# Altium schematic sheet LOCAL_POWER.SchDoc: FMC 5GS/s ADC/TDC
size 420 x 297 mm; Author: Agnieszka Bartkowicz; CompanyName: WUT ISE; DrawnBy: Agnieszka Bartkowicz; Engineer: Agnieszka Bartkowicz; Organization: WUT ISE; Address1: PW ISE; Address2: Nowowiejska 15/19 00-665 Warsaw; Address3: gyorka@o2.pl; SheetNumber: 10; SheetTotal: 14; ModifiedBy: -; CheckedDate: -; Title2: Title 2; DivGrp: WUT ISE; Designer: A. Bartkowicz
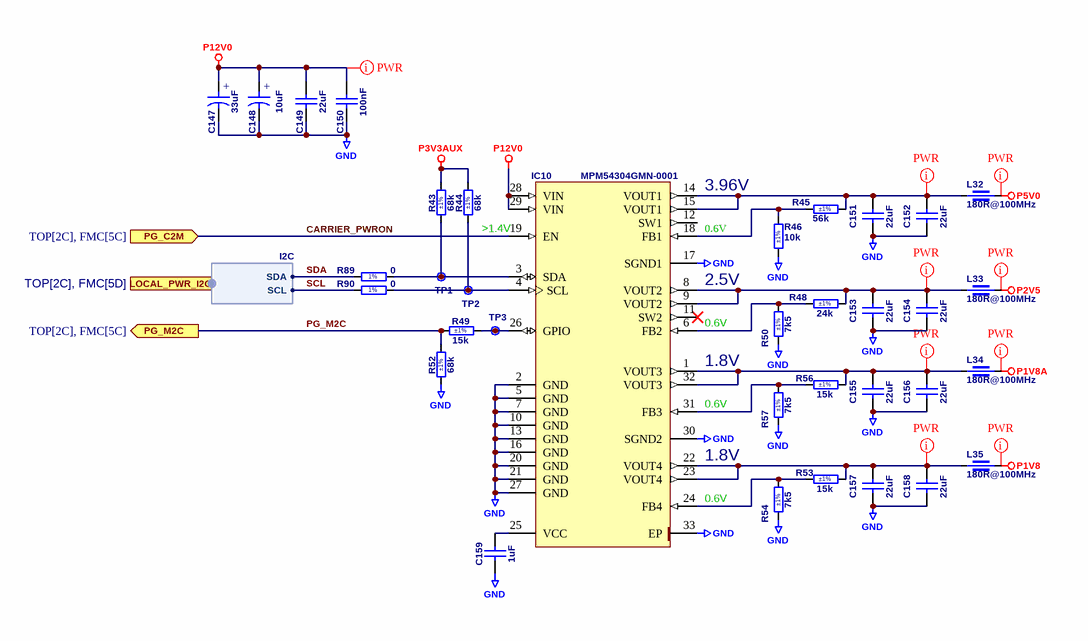
[diagram p0: LOCAL_POWER.SchDoc]

## Parts
C147  33uF  [CAPMP3528X210N]
C148  10uF  [CAPMP3216X180N]
C149  22uF  [CAPC2012X135N]
C150  100nF  [CAPC1005X55N]
C151  22uF  [CAPC2012X135N]
C152  22uF  [CAPC2012X135N]
C153  22uF  [CAPC2012X135N]
C154  22uF  [CAPC2012X135N]
C155  22uF  [CAPC2012X135N]
C156  22uF  [CAPC2012X135N]
C157  22uF  [CAPC2012X135N]
C158  22uF  [CAPC2012X135N]
C159  1uF  [CAPC1005X55N]
IC10  MPM54304GMN-0001  [MPS_MPM54304GMN]
L32  180R@100MHz  [INDC2012X105N]
L33  180R@100MHz  [INDC2012X105N]
L34  180R@100MHz  [INDC2012X105N]
L35  180R@100MHz  [INDC2012X105N]
R43  68k  Tolerance: ±1%  [RESC1005X40N]
R44  68k  Tolerance: ±1%  [RESC1005X40N]
R45  56k  Tolerance: ±1%  [RESC1005X40N]
R46  10k  Tolerance: ±1%  [RESC1005X40N]
R48  24k  Tolerance: ±1%  [RESC1005X40N]
R49  15k  Tolerance: ±1%  [RESC1005X40N]
R50  7k5  Tolerance: ±1%  [RESC1005X40N]
R52  68k  Tolerance: ±1%  [RESC1005X40N]
R53  15k  Tolerance: ±1%  [RESC1005X40N]
R54  7k5  Tolerance: ±1%  [RESC1005X40N]
R56  15k  Tolerance: ±1%  [RESC1005X40N]
R57  7k5  Tolerance: ±1%  [RESC1005X40N]
R89  0  [RESC1005X40N]
R90  0  [RESC1005X40N]
TP1  Test Point  [TPS127]  (value not drawn)  (no BOM)
TP2  Test Point  [TPS127]  (value not drawn)  (no BOM)
TP3  Test Point  [TPS127]  (value not drawn)  (no BOM)

## Ports
LOCAL_PWR_I2C (harness I2C, see TOP[2C], FMC[5D]), PG_C2M (in, see TOP[2C], FMC[5C]), PG_M2C (out, see TOP[2C], FMC[5C])

## Harnesses
I2C: SCL, SDA

## Nets
GND: C147.2 C148.2 C149.1 C150.1 C151.1 C152.1 C153.1 C154.1 C155.1 C156.1 C157.1 C158.1 C159.1 IC10.2(GND) IC10.5(GND) IC10.7(GND) IC10.10(GND) IC10.13(GND) IC10.16(GND) IC10.17(SGND1) IC10.20(GND) IC10.21(GND) IC10.27(GND) IC10.30(SGND2) IC10.33(EP) R46.1 R50.1 R52.1 R54.1 R57.1
P1V8: L35.2
P1V8A: L34.2
P2V5: L33.2
P3V3AUX: R43.2 R44.2
P5V0: L32.2
P12V0: C147.1 C148.1 C149.2 C150.2 IC10.28(VIN) IC10.29(VIN)
CARRIER_PWRON: IC10.19(EN) ; port PG_C2M
PG_M2C: R49.1 R52.2 ; port PG_M2C
SCL: R90.2 ; port LOCAL_PWR_I2C.SCL
SDA: R89.2 ; port LOCAL_PWR_I2C.SDA
NetC151_2: C151.2 C152.2 IC10.14(VOUT1) IC10.15(VOUT1) L32.1 R45.2
NetC153_2: C153.2 C154.2 IC10.8(VOUT2) IC10.9(VOUT2) L33.1 R48.2
NetC155_2: C155.2 C156.2 IC10.1(VOUT3) IC10.32(VOUT3) L34.1 R56.2
NetC157_2: C157.2 C158.2 IC10.22(VOUT4) IC10.23(VOUT4) L35.1 R53.2
NetC159_2: C159.2 IC10.25(VCC)
NetIC10_3: IC10.3(SDA) R43.1 R89.1 TP1.1
NetIC10_4: IC10.4(SCL) R44.1 R90.1 TP2.1
NetIC10_6: IC10.6(FB2) R48.1 R50.2
NetIC10_18: IC10.18(FB1) R45.1 R46.2
NetIC10_24: IC10.24(FB4) R53.1 R54.2
NetIC10_26: IC10.26(GPIO) R49.2 TP3.1
NetIC10_31: IC10.31(FB3) R56.1 R57.2

Not connected (* = marked no-connect by the designer): IC10 11(SW2)* 12(SW1)

## Layout directives
net class PWR: NetC151_2, NetC153_2, NetC155_2, NetC157_2, P1V8, P1V8A, P2V5, P5V0, P12V0

## Notes on the sheet
- 3.96V
- >1.4V
- 0.6V
- 2.5V
- 1.8V
- Project/Equipment
- Document
- Designer
- Drawn by
- Check.by
- Copyright WUT ISE 2024.
  This documentation describes Open Hardware and is licensed under the CERN OHL v.2. You may redistribute and modify this documentation under the terms of the CERN OHL v.2. (http://ohwr.org/CERNOHL). This documentation is distributed WITHOUT ANY EXPRESS OR IMPLIED WARRANTY, INCLUDING OF MERCHANTABILITY, SATISFACTORY QUALITY AND FITNESS FOR A PARTICULAR PURPOSE. Please see the CERN OHL v.2 for applicable conditions.
- Contact
- File
- Last Mod.
- Print Date
- Sheet
- Size
- A3
- of
- Rev
- (in symbol CTE3216-18_10UF_16V_20%_AVX_TCJ) +
- (in symbol CTE3528-21_33UF_16V_10%) +
- (in symbol R0402_0R_JUMPER) 1%

## Library data of the parts
C147 = CTE3528-21_33UF_16V_10%: Polarised capacitor; Part Description: Solid Tantalum Chip Capacitor; Manufacturer: GENERIC; Manufacturer1 Part Number: TAJB336K016R; Voltage: 16V; Tolerance: ±10%; Part Number: CTE3528-21_33UF_16V_10%; Component Kind: Standard; Component Type: Standard; Pin Count: 2; Value: 33uF; Status: Preferred; Manufacturer Part Number: CTE3528-21_33UF_16V_10%; Case: B; Mounted: Yes; Socket: No; SMD: Yes; Sense: No; HelpURL: \\cern.ch\dfs\Applications\Altium\Datasheets\CTE_AVX_TAJ.pdf; Author: CERN DEM JLC; CreateDate: 03.12.2007; LatestRevisionDate: 03.12.2007; Manufacturer1 Example: AVX; Manufacturer1 ComponentHeight: 2.1mm
C148 = CTE3216-18_10UF_16V_20%_AVX_TCJ: Polarised capacitor; Part Description: ESR 0R200 Tantalum Solid Electrolytic Chip Capacitor with Conductive Polymer Electrode; Manufacturer: AVX; Manufacturer Part Number: TCJA106M016R0200; Voltage: 16V; Tolerance: ±20%; Part Number: CTE3216-18_10UF_16V_20%_AVX_TCJ; Component Kind: Standard; Component Type: Standard; Pin Count: 2; Value: 10uF; Status: Preferred; Case: A; Mounted: Yes; Socket: No; SMD: Yes; Sense: No; ComponentHeight: 1.8mm; HelpURL: \\cern.ch\dfs\Applications\Altium\Datasheets\CTE_AVX_TCJ.pdf; Author: CERN DEM JLC; CreateDate: 29.03.2012; LatestRevisionDate: 29.03.2012
C149 C151-C158 = CC0805_22UF_16V_10%_X5R: Non-polarised capacitor; Manufacturer: GENERIC; Part Description: SMD Multilayer Chip Ceramic Capacitor; Manufacturer1 Part Number: C2012X5R1C226KT; Tolerance: ±10%; Voltage: 16V; TC: X5R; Manufacturer Part Number: CC0805_22UF_16V_10%_X5R; Part Number: CC0805_22UF_16V_10%_X5R; Value: 22uF; Component Kind: Standard; Component Type: Standard; Pin Count: 2; Status: Preferred; Case: 0805; Mounted: Yes; Socket: No; SMD: Yes; Sense: No; Manufacturer1 Example: TDK; Manufacturer1 ComponentHeight: 1.35mm; HelpURL: \\cern.ch\dfs\Applications\Altium\Datasheets\CC0805_X5R_TDK_C.pdf; Author: CERN DEM JLC; CreateDate: 25.10.2012; LatestRevisionDate: 25.10.2012
C150 = CC0402_100NF_16V_10%_X7R: Non-polarised capacitor; Part Description: SMD Multilayer Chip Ceramic Capacitor; Manufacturer: GENERIC; Manufacturer1 Part Number: GRM155R71C104KA88D; Voltage: 16V; TC: X7R; Tolerance: ±10%; Part Number: CC0402_100NF_16V_10%_X7R; Component Kind: Standard; Component Type: Standard; Pin Count: 2; Value: 100nF; Status: Not Recommended; Manufacturer Part Number: CC0402_100NF_16V_10%_X7R; Case: 0402; Mounted: Yes; Socket: No; SMD: Yes; Sense: No; Manufacturer1 Example: MURATA; Manufacturer1 ComponentHeight: 0.55mm; HelpURL: \\cern.ch\dfs\Applications\Altium\Datasheets\CC0402_X7R_MURATA_GRM.pdf; Author: CERN DEM JLC; CreateDate: 05/12/2013; LatestRevisionDate: 03/12/2007
C159 = CC0402_1UF_16V_10%_X5R: Non-polarised capacitor; Part Description: SMD Multilayer Chip Ceramic Capacitor; Manufacturer: GENERIC; Manufacturer1 Part Number: C1005X5R1C105KT; Voltage: 16V; TC: X5R; Tolerance: ±10%; Part Number: CC0402_1UF_16V_10%_X5R; Component Kind: Standard; Component Type: Standard; Pin Count: 2; Value: 1uF; Status: Preferred; Manufacturer Part Number: CC0402_1UF_16V_10%_X5R; Case: 0402; Mounted: Yes; Socket: No; SMD: Yes; Sense: No; Manufacturer1 Example: TDK; Manufacturer1 ComponentHeight: 0.55mm; HelpURL: \\cern.ch\dfs\Applications\Altium\Datasheets\CC0402_X5R_TDK_C.pdf; Author: CERN DEM JLC; CreateDate: 25.10.2012; LatestRevisionDate: 25.10.2012
IC10 = MPM54304GMN-XXXX: Quad-Output Power Module with I2C and MTP; Part Description: 4V to 16V Input, Quad-Output Power Module with I2C and MTP; Manufacturer: MPS (MONOLITIC  POWER SYSTEMS); Manufacturer Part Number: MPM54304GMN-002; PressFit: No; Bonding: No; Part Number: MPM54304GMN-0001; Component Kind: Standard; Component Type: Standard; Device: MPM54304GMN-0001; PackageDescription: MPS LGA-33 Case, 0.65mm Pitch, Rect.; 32 Pin, 7.00mm L X 7.00mm W X 2.10mm H body (w/Thermal Tab 3.55 X 3.55mm); Pin Count: 33; Case: QFN32; Mounted: Yes; Socket: No; SMD: Yes; Sense: No; ComponentHeight: 2.1mm; HelpURL: \\cern.ch\dfs\Applications\Altium\Datasheets\MPM54304GMN.pdf; Author: CERN DEM BC; CreateDate: 09.11.2020; LatestRevisionDate: 23.11.2022
L32-L35 = IND0805_MURATA_BLM21SP181BH1D: Part Description: SMD EMIFIL Chip Ferrite Bead; Manufacturer: MURATA; Power: 4A; Resistance: 0.02R; Tolerance: ±25%; Part Number: IND0805_MURATA_BLM21SP181BH1D; Component Kind: Standard; Component Type: Standard; Pin Count: 2; Value: 180R@100MHz; Manufacturer Part Number: BLM21SP181BH1; Case: 0805; Mounted: Yes; Socket: No; SMD: Yes; Sense: No; ComponentHeight: 1.05mm; HelpURL: \\cern.ch\dfs\Applications\Altium\Datasheets\IND0805_MURATA_BLM21SP181BH1.pdf; Author: CERN DEM JMW; CreateDate: 30.07.2021; LatestRevisionDate: 30.07.2021
R43 R44 R52 = R0402_68K_1%_0.0625W_100PPM: Resistor - 1%; Part Description: General Purpose Thick Film Chip Resistor; Manufacturer: GENERIC; Manufacturer1 Part Number: 232270676803L; TC: ±100ppm/°C; PressFit: No; Part Number: R0402_68K_1%_0.0625W_100PPM; Component Kind: Standard; Component Type: Standard; Pin Count: 2; Value: 68k; Status: Not Recommended; Power: 0.0625W; Manufacturer Part Number: R0402_68K_1%_0.0625W_100PPM; Case: 0402; Mounted: Yes; Sense: No; Socket: No; SMD: Yes; Manufacturer1 Example: YAGEO PHYCOMP; Manufacturer1 ComponentHeight: 0.4mm; HelpURL: \\cern.ch\dfs\Applications\Altium\Datasheets\R0402_Phycomp_RC0402.pdf; Author: CERN DEM JLC; CreateDate: 03.12.2007; LatestRevisionDate: 17.10.2012
R45 = R0402_56K_1%_0.0625W_100PPM: Resistor - 1%; Part Description: General Purpose Thick Film Chip Resistor; Manufacturer: GENERIC; Manufacturer1 Part Number: 232270675603L; TC: ±100ppm/°C; PressFit: No; Part Number: R0402_56K_1%_0.0625W_100PPM; Component Kind: Standard; Component Type: Standard; Pin Count: 2; Value: 56k; Status: Not Recommended; Power: 0.0625W; Manufacturer Part Number: R0402_56K_1%_0.0625W_100PPM; Case: 0402; Mounted: Yes; Sense: No; Socket: No; SMD: Yes; Manufacturer1 Example: YAGEO PHYCOMP; Manufacturer1 ComponentHeight: 0.4mm; HelpURL: \\cern.ch\dfs\Applications\Altium\Datasheets\R0402_Phycomp_RC0402.pdf; Author: CERN DEM JLC; CreateDate: 03.12.2007; LatestRevisionDate: 17.10.2012
R46 = R0402_10K_1%_0.0625W_100PPM: Resistor - 1%; Part Description: General Purpose Thick Film Chip Resistor; Manufacturer: GENERIC; Manufacturer1 Part Number: 232270671003L; TC: ±100ppm/°C; PressFit: No; Part Number: R0402_10K_1%_0.0625W_100PPM; Component Kind: Standard; Component Type: Standard; Pin Count: 2; Value: 10k; Status: Not Recommended; Power: 0.0625W; Manufacturer Part Number: R0402_10K_1%_0.0625W_100PPM; Case: 0402; Mounted: Yes; Sense: No; Socket: No; SMD: Yes; Manufacturer1 Example: YAGEO PHYCOMP; Manufacturer1 ComponentHeight: 0.4mm; HelpURL: \\cern.ch\dfs\Applications\Altium\Datasheets\R0402_Phycomp_RC0402.pdf; Author: CERN DEM JLC; CreateDate: 03.12.2007; LatestRevisionDate: 17.10.2012
R48 = R0402_24K_1%_0.0625W_100PPM: Resistor - 1%; Part Description: General Purpose Thick Film Chip Resistor; Manufacturer: GENERIC; Manufacturer1 Part Number: 232270672403L; TC: ±100ppm/°C; PressFit: No; Part Number: R0402_24K_1%_0.0625W_100PPM; Component Kind: Standard; Component Type: Standard; Pin Count: 2; Value: 24k; Status: Not Recommended; Power: 0.0625W; Manufacturer Part Number: R0402_24K_1%_0.0625W_100PPM; Case: 0402; Mounted: Yes; Sense: No; Socket: No; SMD: Yes; Manufacturer1 Example: YAGEO PHYCOMP; Manufacturer1 ComponentHeight: 0.4mm; HelpURL: \\cern.ch\dfs\Applications\Altium\Datasheets\R0402_Phycomp_RC0402.pdf; Author: CERN DEM JLC; CreateDate: 03.12.2007; LatestRevisionDate: 17.10.2012
R49 R53 R56 = R0402_15K_1%_0.0625W_100PPM: Resistor - 1%; Part Description: General Purpose Thick Film Chip Resistor; Manufacturer: GENERIC; Manufacturer1 Part Number: CRCW040215K0FK; TC: ±100ppm/°C; PressFit: No; Part Number: R0402_15K_1%_0.0625W_100PPM; Component Kind: Standard; Component Type: Standard; Pin Count: 2; Value: 15k; Status: Preferred; Power: 0.0625W; Manufacturer Part Number: R0402_15K_1%_0.0625W_100PPM; Case: 0402; Mounted: Yes; Sense: No; Socket: No; SMD: Yes; Manufacturer1 Example: VISHAY; Manufacturer1 ComponentHeight: 0.4mm; HelpURL: \\cern.ch\dfs\Applications\Altium\Datasheets\R0402_VISHAY_CRCW e3.pdf; Author: CERN DEM JMW; CreateDate: 06.07.2015; LatestRevisionDate: 06.07.2015
R50 R54 R57 = R0402_7K5_1%_0.0625W_100PPM: Resistor - 1%; Part Description: General Purpose Thick Film Chip Resistor; Manufacturer: GENERIC; Manufacturer1 Part Number: 232270677502L; TC: ±100ppm/°C; PressFit: No; Part Number: R0402_7K5_1%_0.0625W_100PPM; Component Kind: Standard; Component Type: Standard; Pin Count: 2; Value: 7k5; Status: Not Recommended; Power: 0.0625W; Manufacturer Part Number: R0402_7K5_1%_0.0625W_100PPM; Case: 0402; Mounted: Yes; Sense: No; Socket: No; SMD: Yes; Manufacturer1 Example: YAGEO PHYCOMP; Manufacturer1 ComponentHeight: 0.4mm; HelpURL: \\cern.ch\dfs\Applications\Altium\Datasheets\R0402_Phycomp_RC0402.pdf; Author: CERN DEM JLC; CreateDate: 03.12.2007; LatestRevisionDate: 17.10.2012
R89 R90 = R0402_0R_JUMPER: Resistor - 1%; Part Description: 1A (0.05R Max DC Resistance) Zero Ohm Jumper; Manufacturer: GENERIC; Manufacturer1 Part Number: 232270591001; Table: Resistors SMD; Part Number: R0402_0R_JUMPER; Component Kind: Standard; Component Type: Standard; Pin Count: 2; Value: 0; Status: Not recommended; Manufacturer Part Number: R0402_0R_JUMPER; Case: 0402; Mounted: Yes; Socket: No; SMD: Yes; Manufacturer1 Example: PHYCOMP; Manufacturer1 ComponentHeight: 0.4mm; HelpURL: \\cern.ch\dfs\Applications\Altium\Datasheets\R0402_Phycomp_RC0402.pdf; Author: CERN DEM JLC; CreateDate: 2007-12-03; LatestRevisionDate: 2008-03-13
TP1-TP3 = SMD_PAD_1.27X1.27MM: Part Description: 1.27mm x 1.27mm PCB Copper Area (SMD Test Point); Mounted: No; Part Number: SMD_PAD_1.27X1.27MM; Component Type: Standard (No BOM); Pin Count: 1; Family: Test Point; Socket: No; SMD: Yes; Sense: No; Status: None; ComponentHeight: 0mm; HelpURL: Undefined; Author: CERN DEM JLC; CreateDate: 12.01.2008; LatestRevisionDate: 12.01.2008; PackageDescription: 1.27mm x 1.27mm PCB Copper Area (SMD Test Point)